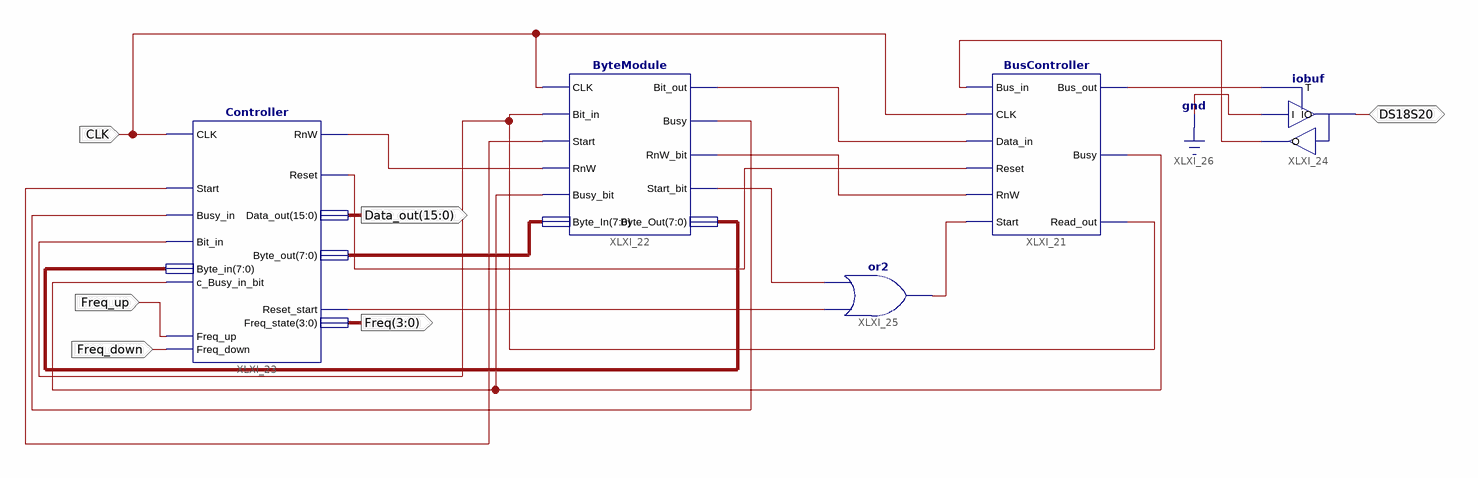
[diagram p0: schematic sheet 1]
// Xilinx ISE schematic termometer.sch (spartan3e) as structural Verilog: 5 symbols, 6 ports
module termometer (
  input  CLK,
  input  Freq_up,
  input  Freq_down,
  inout  DS18S20,
  output [3:0] Freq,
  output [15:0] Data_out
);

  wire XLXN_43, XLXN_44, XLXN_45, XLXN_49, XLXN_55, XLXN_56, XLXN_57, XLXN_58, XLXN_59, XLXN_61, XLXN_62,
       XLXN_63, XLXN_66;
  wire [7:0] XLXN_47, XLXN_60;

  ByteModule XLXI_22 (
    .CLK(CLK), .Bit_in(XLXN_62), .Start(XLXN_59), .RnW(XLXN_49), .Busy_bit(XLXN_61), .Byte_In(XLXN_47),
    .Bit_out(XLXN_55), .Busy(XLXN_56), .RnW_bit(XLXN_57), .Start_bit(XLXN_44), .Byte_Out(XLXN_60));
  Controller XLXI_23 (
    .CLK(CLK), .Freq_up(Freq_up), .Freq_down(Freq_down), .Busy_in(XLXN_56), .c_Busy_in_bit(XLXN_61),
    .Bit_in(XLXN_62), .Byte_in(XLXN_60), .Start(XLXN_59), .RnW(XLXN_49), .Reset(XLXN_58),
    .Reset_start(XLXN_45), .Data_out(Data_out), .Byte_out(XLXN_47), .Freq_state(Freq));
  iobuf XLXI_24 (.I(1'b0), .IO(DS18S20), .O(XLXN_66), .T(XLXN_63));
  or XLXI_25 (XLXN_43, XLXN_45, XLXN_44);
  BusController XLXI_21 (
    .Bus_in(XLXN_66), .CLK(CLK), .Data_in(XLXN_55), .Reset(XLXN_58), .RnW(XLXN_57), .Start(XLXN_43),
    .Bus_out(XLXN_63), .Busy(XLXN_61), .Read_out(XLXN_62));
endmodule
